# Altium schematic sheet block schematic.SchDoc
size A4; DocumentNumber: 15; SheetNumber: 15; SheetTotal: 30
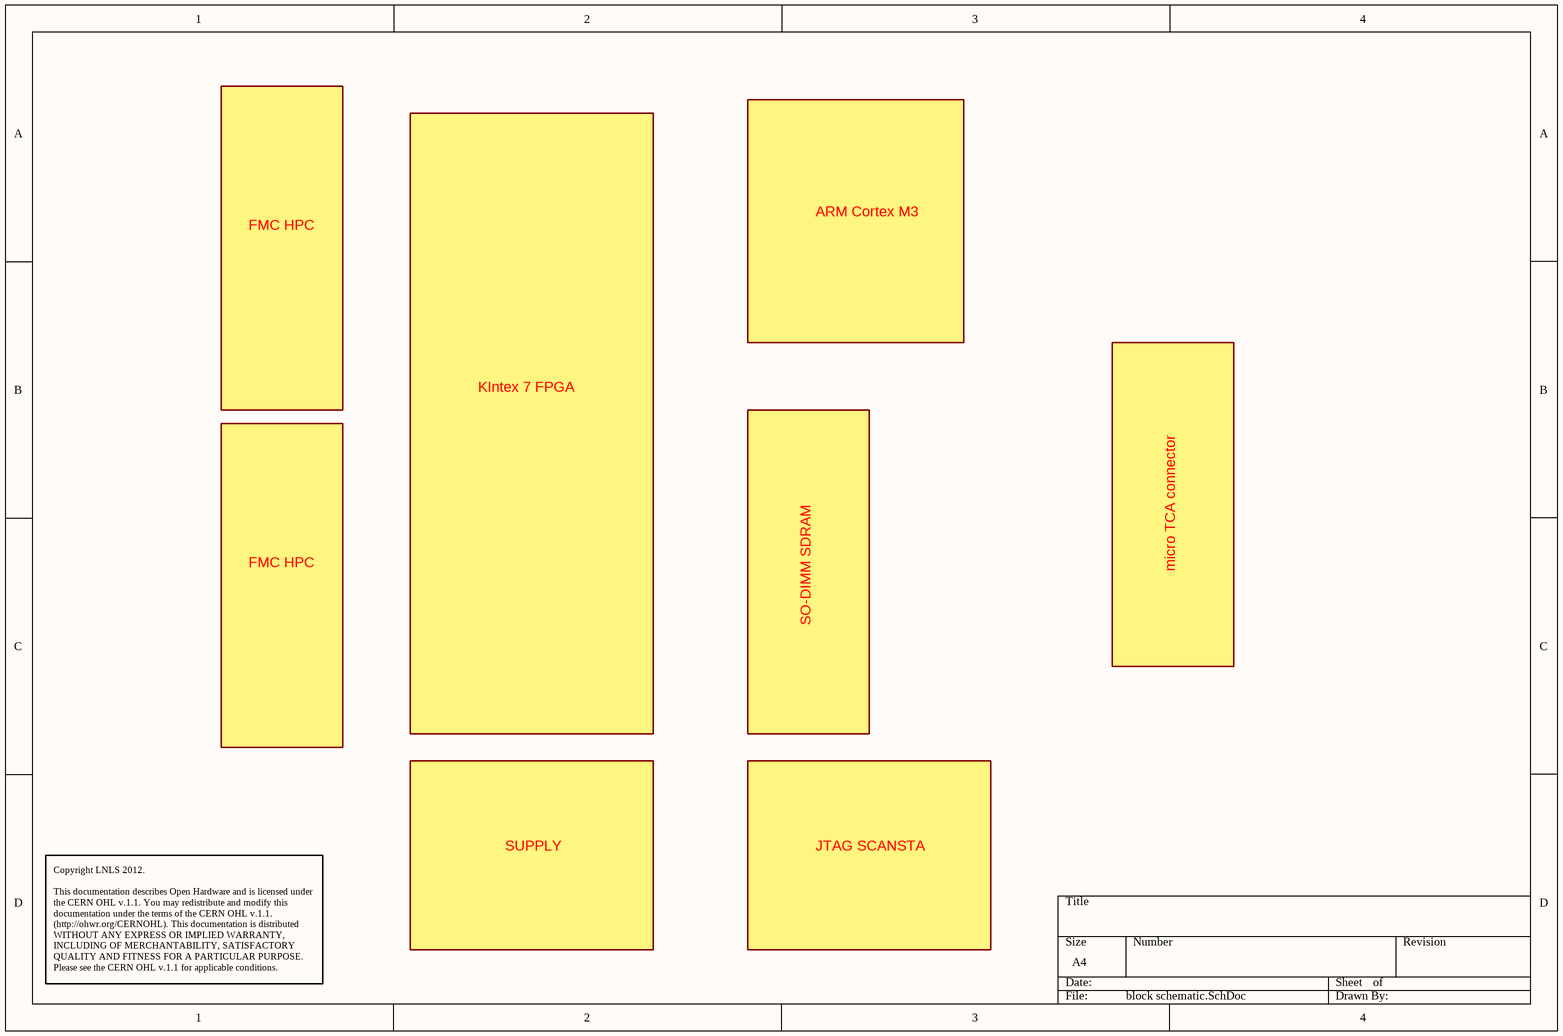
[diagram p0: block schematic.SchDoc]

## Notes on the sheet
- FMC HPC
- ARM Cortex M3
- KIntex 7 FPGA
- micro TCA connector
- SO-DIMM SDRAM
- SUPPLY
- JTAG SCANSTA
- Copyright LNLS 2012.
  This documentation describes Open Hardware and is licensed under the CERN OHL v.1.1. You may redistribute and modify this documentation under the terms of the CERN OHL v.1.1. (http://ohwr.org/CERNOHL). This documentation is distributed WITHOUT ANY EXPRESS OR IMPLIED WARRANTY, INCLUDING OF MERCHANTABILITY, SATISFACTORY QUALITY AND FITNESS FOR A PARTICULAR PURPOSE. Please see the CERN OHL v.1.1 for applicable conditions.